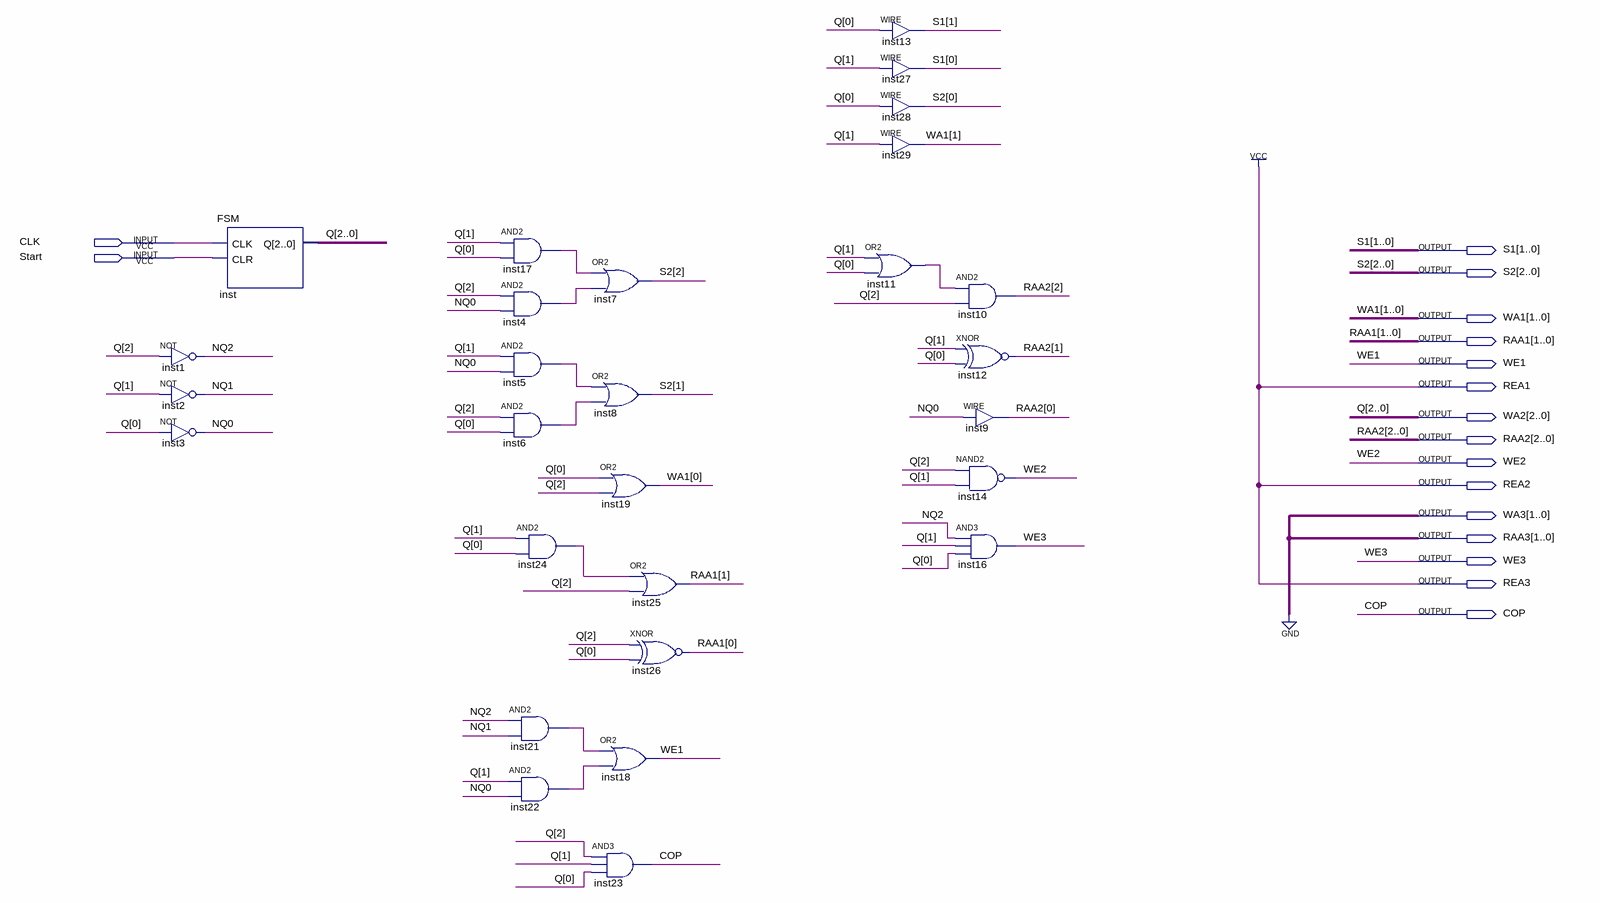
[diagram p0: schematic sheet]
// Quartus schematic Control.bdf as structural Verilog: 28 symbols, 17 pins
module Control (
  input  CLK,
  input  Start,
  output [1:0] S1,
  output [2:0] S2,
  output [1:0] WA1,
  output [1:0] RAA1,
  output WE1,
  output REA1,
  output [2:0] WA2,
  output [2:0] RAA2,
  output WE2,
  output REA2,
  output [1:0] WA3,
  output [1:0] RAA3,
  output WE3,
  output REA3,
  output COP
);

  wire inst4_out, inst5_out, inst6_out, inst11_out, inst17_out, inst21_out, inst22_out, inst24_out, NQ0, NQ1,
       NQ2;

  not inst1 (NQ2, WA2[2]);
  not inst2 (NQ1, WA2[1]);
  not inst3 (NQ0, WA2[0]);
  FSM inst (.CLK(CLK), .CLR(Start), .Q(WA2));
  and inst17 (inst17_out, WA2[1], WA2[0]);
  and inst4 (inst4_out, WA2[2], NQ0);
  and inst5 (inst5_out, WA2[1], NQ0);
  and inst6 (inst6_out, WA2[2], WA2[0]);
  and inst24 (inst24_out, WA2[1], WA2[0]);
  and inst21 (inst21_out, NQ2, NQ1);
  and inst22 (inst22_out, WA2[1], NQ0);
  or inst7 (S2[2], inst17_out, inst4_out);
  or inst8 (S2[1], inst5_out, inst6_out);
  or inst19 (WA1[0], WA2[0], WA2[2]);
  or inst18 (WE1, inst21_out, inst22_out);
  and inst23 (COP, WA2[2], WA2[1], WA2[0]);
  or inst25 (RAA1[1], inst24_out, WA2[2]);
  xnor inst26 (RAA1[0], WA2[2], WA2[0]);
  assign S1[1] = WA2[0];  // WIRE inst13
  assign S1[0] = WA2[1];  // WIRE inst27
  assign S2[0] = WA2[0];  // WIRE inst28
  assign WA1[1] = WA2[1];  // WIRE inst29
  or inst11 (inst11_out, WA2[1], WA2[0]);
  and inst10 (RAA2[2], inst11_out, WA2[2]);
  xnor inst12 (RAA2[1], WA2[1], WA2[0]);
  assign RAA2[0] = NQ0;  // WIRE inst9
  nand inst14 (WE2, WA2[2], WA2[1]);
  and inst16 (WE3, NQ2, WA2[1], WA2[0]);

  assign RAA3 = 2'b00;
  assign REA1 = 1'b1;
  assign REA2 = 1'b1;
  assign REA3 = 1'b1;
  assign WA3 = 2'b00;

  // Other names for the same wires on the sheet: Q[2:0] = WA2
endmodule
